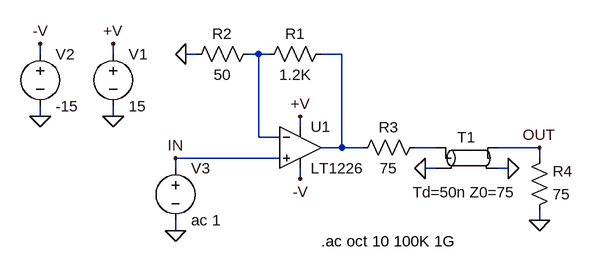
[diagram p0: schematic 1226.asc]
1226.asc, the LTspice schematic file:
Version 4
SHEET 1 896 680
WIRE -208 96 -208 80
WIRE -96 96 -96 80
WIRE 32 96 16 96
WIRE 128 96 112 96
WIRE 144 96 128 96
WIRE 256 96 224 96
WIRE -208 192 -208 176
WIRE -96 192 -96 176
WIRE 192 208 192 192
WIRE 128 224 128 96
WIRE 160 224 128 224
WIRE 256 240 256 96
WIRE 256 240 224 240
WIRE 288 240 256 240
WIRE 400 240 368 240
WIRE 560 240 496 240
WIRE 160 256 0 256
WIRE 560 256 560 240
WIRE 0 272 0 256
WIRE 400 272 384 272
WIRE 512 272 496 272
WIRE 192 288 192 272
WIRE 560 352 560 336
WIRE 0 368 0 352
FLAG -96 192 0
FLAG 192 192 +V
FLAG -96 80 +V
FLAG 192 288 -V
FLAG -208 192 0
FLAG -208 80 -V
FLAG 16 96 0
FLAG 0 368 0
FLAG 560 352 0
FLAG 512 272 0
FLAG 384 272 0
FLAG 560 240 OUT
FLAG 0 256 IN
SYMBOL voltage -96 80 R0
SYMATTR InstName V1
SYMATTR Value 15
SYMBOL voltage -208 80 R0
SYMATTR InstName V2
SYMATTR Value -15
SYMBOL res 240 80 R90
WINDOW 0 0 56 VBottom 0
WINDOW 3 32 56 VTop 0
SYMATTR InstName R1
SYMATTR Value 1.2K
SYMBOL res 128 80 R90
WINDOW 0 0 56 VBottom 0
WINDOW 3 32 56 VTop 0
SYMATTR InstName R2
SYMATTR Value 50
SYMBOL voltage 0 256 R0
SYMATTR InstName V3
SYMATTR Value ac 1
SYMBOL opamps\\LT1226 192 176 R0
SYMATTR InstName U1
SYMBOL res 384 224 R90
WINDOW 0 0 56 VBottom 0
WINDOW 3 32 56 VTop 0
SYMATTR InstName R3
SYMATTR Value 75
SYMBOL res 544 352 M180
WINDOW 0 36 76 Left 0
WINDOW 3 36 40 Left 0
SYMATTR InstName R4
SYMATTR Value 75
SYMBOL tline 448 256 R0
WINDOW 3 -3 37 Top 0
SYMATTR Value Td=50n Z0=75
SYMATTR InstName T1
TEXT 224 384 Left 0 !.ac oct 10 100K 1G

The netlist it stands for:
* 1226.asc
V1 +V 0 15
V2 -V 0 -15
R1 N002 N001 1.2K
R2 N001 0 50
V3 IN 0 ac 1
XU1 IN N001 +V -V N002 LT1226  ; pins In+ In- V+ V- OUT
R3 N003 N002 75
R4 0 OUT 75
T1 N003 0 OUT 0 Td=50n Z0=75
.ac oct 10 100K 1G
.backanno
.end